# EAGLE design LightLog_SMD_0.7 (EAGLE 7.1.0)
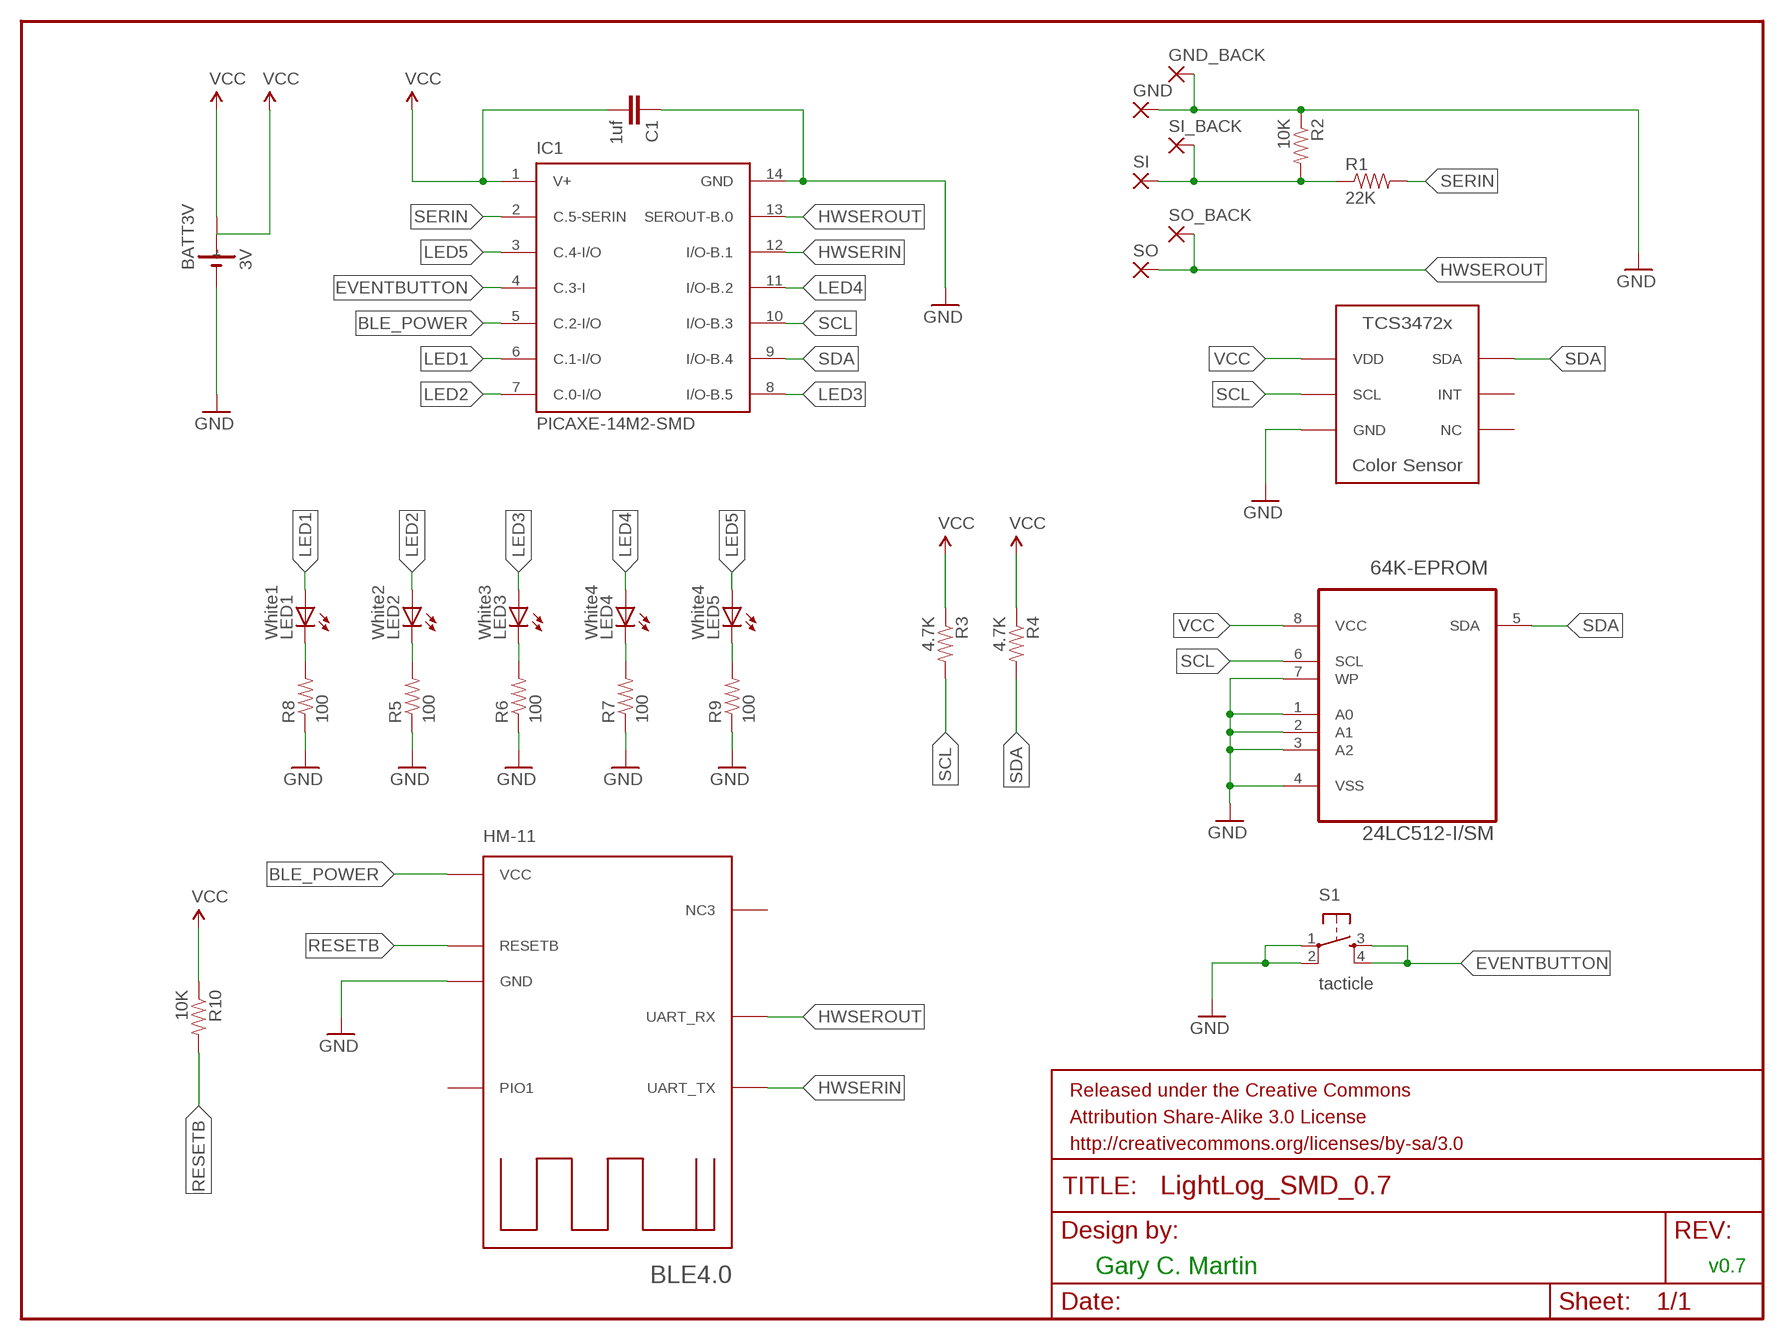
[diagram p0: schematic, sheet 1]

## Parts
64K-EPROM  24LC512-I/SM  [SOIC127P794X203-8N]
BATT3V  3V  BAT-HLD-001-CR2032  [BAT-HLD-001-CR2032-SMD]
BLE4.0  HM-11  HM-11-MIN  [HM-11-MIN]
C1  1uf  CAP0805  [0805]
GND  SMD2  [SMD1,27-2,54]
GND_BACK  SMD2  [SMD1,27-2,54]
IC1  PICAXE-14M2-SMD  [SOIC14]
LED1  White1  LED0603  [LED-0603]
LED2  White2  LED0603  [LED-0603]
LED3  White3  LED0603  [LED-0603]
LED4  White4  LED0603  [LED-0603]
LED5  White4  LED0603  [LED-0603]
R1  22K  RESISTOR0805-RES  [0805]
R2  10K  RESISTOR0805-RES  [0805]
R3  4.7K  RESISTOR0805-RES  [0805]
R4  4.7K  RESISTOR0805-RES  [0805]
R5  100  RESISTOR0805-RES  [0805]
R6  100  RESISTOR0805-RES  [0805]
R7  100  RESISTOR0805-RES  [0805]
R8  100  RESISTOR0805-RES  [0805]
R9  100  RESISTOR0805-RES  [0805]
R10  10K  RESISTOR0805-RES  [0805]
S1  tacticle  TAC_SWITCHSMD  [TACTILE_SWITCH_SMD]
SI  SMD2  [SMD1,27-2,54]
SI_BACK  SMD2  [SMD1,27-2,54]
SO  SMD2  [SMD1,27-2,54]
SO_BACK  SMD2  [SMD1,27-2,54]
U$1  TCS3472  [DUAL-FLAT-NO-LEAD-6PIN]

## Nets
BLE_POWER: BLE4.0.VCC IC1.5(C.2-I/O)
EVENTBUTTON: IC1.4(C.3-I) S1.3 S1.4
GND: 64K-EPROM.1(A0) 64K-EPROM.2(A1) 64K-EPROM.3(A2) 64K-EPROM.4(VSS) 64K-EPROM.7(WP) BATT3V.NEG(-) BLE4.0.GND C1.1 GND.1(P) GND_BACK.1(P) IC1.14(GND) R2.1 R5.1 R6.1 R7.1 R8.1 R9.1 S1.1 S1.2 U$1.3(GND)
HWSERIN: BLE4.0.UART_TX IC1.12(I/O-B.1)
HWSEROUT: BLE4.0.UART_RX IC1.13(SEROUT-B.0) SO.1(P) SO_BACK.1(P)
LED1: IC1.6(C.1-I/O) LED1.A
LED2: IC1.7(C.0-I/O) LED2.A
LED3: IC1.8(I/O-B.5) LED3.A
LED4: IC1.11(I/O-B.2) LED4.A
LED5: IC1.3(C.4-I/O) LED5.A
N$1: LED2.C R5.2
N$2: R1.1 R2.2 SI.1(P) SI_BACK.1(P)
N$3: LED3.C R6.2
N$4: LED4.C R7.2
N$5: LED5.C R9.2
N$11: LED1.C R8.2
RESETB: BLE4.0.RESETB R10.2
SCL: 64K-EPROM.6(SCL) IC1.10(I/O-B.3) R3.2 U$1.2(SCL)
SDA: 64K-EPROM.5(SDA) IC1.9(I/O-B.4) R4.2 U$1.6(SDA)
SERIN: IC1.2(C.5-SERIN) R1.2
VCC: 64K-EPROM.8(VCC) BATT3V.POS1(+) BATT3V.POS2(+) C1.2 IC1.1(V+) R3.1 R4.1 R10.1 U$1.1(VDD)
Unconnected: BLE4.0.NC3 BLE4.0.POI1(PIO1) U$1.4(NC) U$1.5(INT)

## Notes on the sheet
- Gary C. Martin | v0.7

## Library data of the parts
64K-EPROM = gary:24LC512-I/SM: 512K I2C Serial EEPROM; MPN: 24LC512-I/SM; OC_FARNELL: 9758038; OC_NEWARK: 62K0582; PACKAGE: SOIC-8; SUPPLIER: MICROCHIP
BATT3V = gary:BAT-HLD-001-CR2032: CR2032 Holder CR2032 surface mount battery holder
BLE4.0 = gary:HM-11-MIN
C1 = SparkFun-Capacitors:CAP: Capacitor Standard 0603 ceramic capacitor, and 0.1" leaded capacitor.
GND GND_BACK SI SI_BACK SO SO_BACK = wirepad:SMD2: SMD PAD
IC1 = LightLog_SMD_0.6:PICAXE-14M2: PICAXE-14M2 Pic microcontroler.
LED1-LED5 = SparkFun-LED:LED: LEDs Standard schematic elements and footprints for 5mm, 3mm, 1206, and 0603 sized LEDs. 5mm - Spark Fun Electronics SKU : COM-00529 (and others)
R1-R10 = SparkFun-Resistors:RESISTOR: Resistor Basic schematic elements and footprints for 0603, 1206, and PTH resistors.
S1 = gary:TAC_SWITCH: Momentary Switch Button commonly used for reset or general input.
U$1 = gary:TCS3472: TCS3472x device

## Board
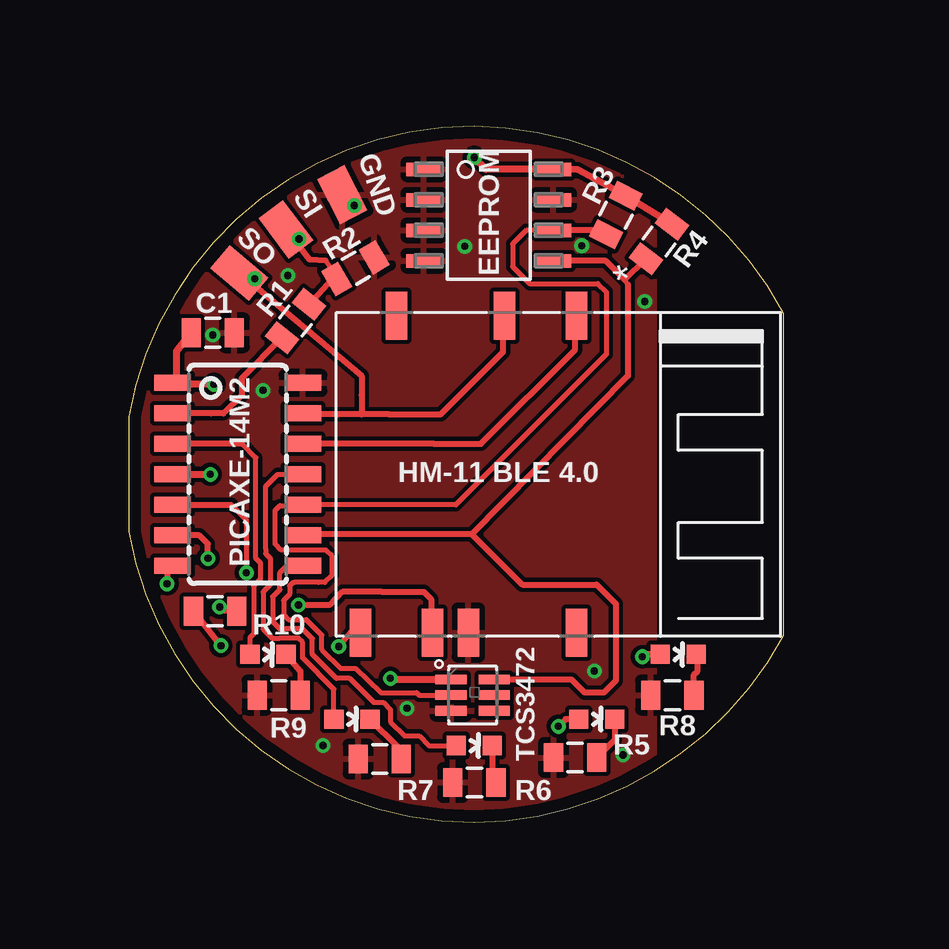
[diagram p1: board, top side]
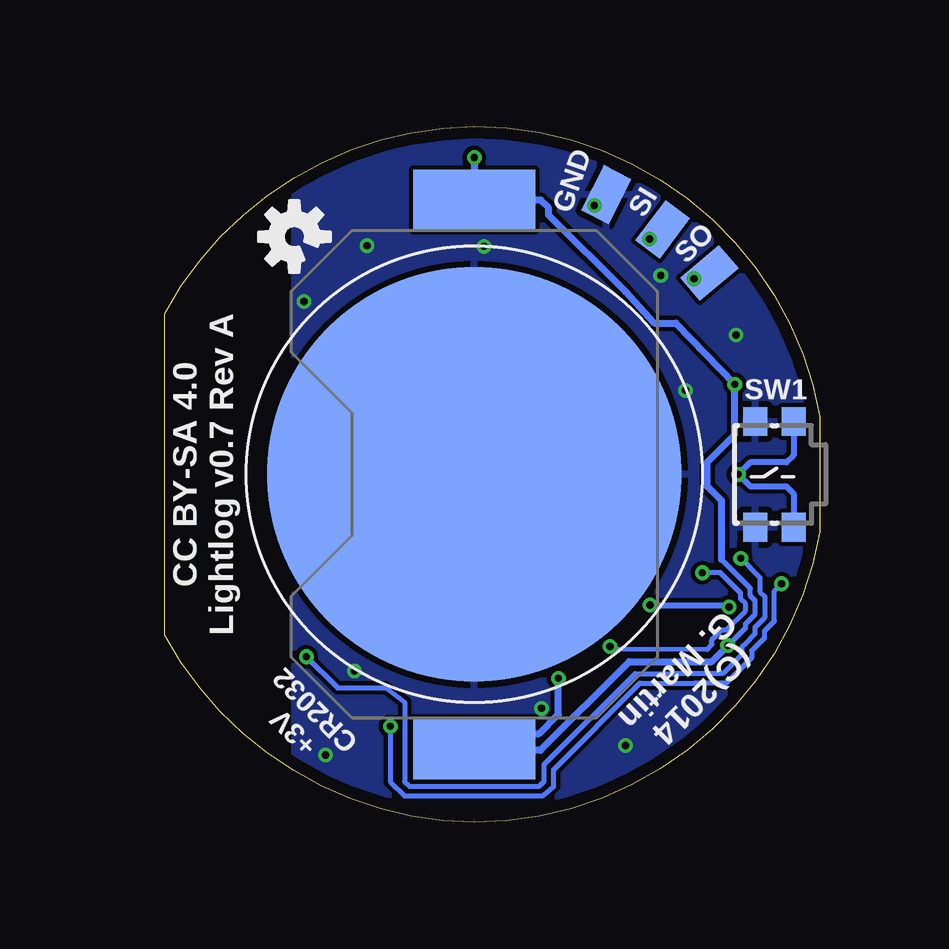
[diagram p2: board, bottom side, seen from below]

Size 27.3 x 29 mm. Coordinates in mm from the lower left corner, seen from the top.
Outline: 14.4,0 arc61 27.3,7.8 27.3,13.5 27.3,15.5 27.3,21.2 arc61 14.4,29 arc80 0,16.9 0,14.7 0,12.1 arc80 14.4,0
Copper layers (1*16): Top 0.035mm / dielectric 1.5mm / Bottom 0.035mm
Design rules "Smart-Prototyping-com-EagleRules *": minimum track width 7mil, minimum drill 12mil, track to track 7mil, track to pad 7mil, pad to pad 7mil, via to via 7mil, smd to smd 0mil, copper to edge 20mil, drill to drill 10mil, minimum pad ring 10mil, minimum via ring 6mil, stop-mask expansion 2mil, vias tented up to drill 25mil, thermal gap 10mil

### Footprints (pad centres in the part's own frame; a part is rotated, then mirrored left to right if it is on the bottom)
SOIC127P794X203-8N = smd 1.473 x 0.559: 1 -2.739,1.905; 2 -2.739,0.635; 3 -2.739,-0.635; 4 -2.739,-1.905; 5 2.659,-1.905; 6 2.659,-0.635; 7 2.659,0.635; 8 2.659,1.905
BAT-HLD-001-CR2032-SMD = smd 17.272 x 17.272: NEG 0,0 | smd 2.54 x 5.08: POS1 -11.43,0; POS2 11.43,0
HM-11-MIN = smd 2 x 0.9: GND 6.6,-3.75; NC3 -6.6,-6.75; POI1 6.6,0.75; RESETB 6.6,-5.25; UART_RX -6.6,-2.25; UART_TX -6.6,0.75; VCC 6.6,-8.25
0805 = smd 0.8 x 1.2: 1 -0.9,0; 2 0.9,0
SMD1,27-2,54 = smd 1.27 x 2.1: 1 0,0
SOIC14 = smd 1.524 x 0.66: 1 -2.878,3.81; 2 -2.878,2.54; 3 -2.878,1.27; 4 -2.878,0; 5 -2.878,-1.27; 6 -2.878,-2.54; 7 -2.878,-3.81; 8 2.561,-3.81; 9 2.561,-2.54; 10 2.561,-1.27; 11 2.561,0; 12 2.561,1.27; 13 2.561,2.54; 14 2.561,3.81
LED-0603 = smd 0.8 x 0.8: A 0,-0.75; C 0,0.75
TACTILE_SWITCH_SMD = smd 1.2 x 1: 1 -2.2,0.805; 2 2.2,0.805; 3 -2.2,-0.805; 4 2.2,-0.805
DUAL-FLAT-NO-LEAD-6PIN = smd 1.3 x 0.4: 1 -0.9,0.65; 2 -0.9,0; 3 -0.9,-0.65; 4 0.9,-0.65; 5 0.9,0; 6 0.9,0.65

### Placement (x,y rotation side)
64K-EPROM  15.04,25.3 0 top
BATT3V  14.4,14.5 270 bottom
BLE4.0  17.9,14.5 270 top
C1  3.5,20.4 180 top
GND  8.9,26.15 207 top
GND_BACK  8.9,26.15 333 bottom
IC1  4.7,14.5 0 top
LED1  22.9,7 270 top
LED2  19.5,4.3 270 top
LED3  14.4,3.2 270 top
LED4  9.3,4.3 270 top
LED5  5.8,7 270 top
LOGO2  OSHW-LOGOS  [OSHW-LOGO-S]  21.9,24.4 45 bottom
R1  6.95,20.88 231 top
R2  9.45,23.09 210 top
R3  20.3,25.3 243 top
R4  22.1,24.2 233 top
R5  18.6,2.7 0 top
R6  14.4,1.66 0 top
R7  10.46,2.64 0 top
R8  22.65,5.3 0 top
R9  6.25,5.3 0 top
R10  3.6,8.8 0 top
S1  1.9,14.5 90 bottom
SI  6.55,24.71 217 top
SI_BACK  6.55,24.71 143 bottom
SO  4.6,22.89 230 top
SO_BACK  4.6,22.89 130 bottom
U$1  14.33,5.3 0 top

### Tracks (layer width: path | path; a pad name or v marks a point on that pad's centre or on a via)
BLE_POWER  (via drill 0.3)
  Top 0.2: 4.27,13.23 4.9,12.6 v4.9,10.4 | BLE4.0.VCC 9.25,7.9
  Top 0.254: IC1.5 4.27,13.23 | 9.25,7.9 v8.75,7.33
  Bottom 0.2: v4.9,10.4 4.15,10.4 3.3,9.55 3.3,9.3 3.1,9.1 3.1,8.82 3.9,8.02 4.1,8.02 4.5,7.6 4.5,7.4 4.7,7.2 8.64,7.22 v8.75,7.33
EVENTBUTTON  (via drill 0.3)
  Top 0.3: IC1.4 v3.4,14.5
  Bottom 0.254: S1.4 1.09,15.3 1.4,15 2.9,15 v3.4,14.5 2.9,14 1.4,14 1.09,13.7 S1.3
GND  (via drill 0.3)
  other vias: 14,24 6.63,22.78 18.87,24.03 3.5,20.3 19.4,6.3 8.1,3.2 21.5,21.7 5.6,18 20.6,2.8 9.4,25.7 11.6,4.75
  pour Top: -1.1,29.5 21.9,29.5 21.9,-1 -1.1,-1
  pour Bottom: -0.6,29 21.9,29 21.9,-0.5 -0.6,-0.5
HWSERIN
  Top 0.2: 18.6,21.05 BLE4.0.UART_TX
  Top 0.254: IC1.12 12.72,15.77 14.67,15.77 18.6,19.7 18.6,21.05
HWSEROUT  (via drill 0.3)
  Top 0.2: 9.7,17 8.7,17 | v5.25,22.65 4.89,22.89 SO_BACK.1 | 15.6,21.05 BLE4.0.UART_RX
  Top 0.254: SO_BACK.1 9.7,18.6 9.7,17.8 9.7,17 | 7.4,17 8.7,17 9.7,17 | 9.7,17 10.85,17 13,17 15.6,19.6 15.6,21.05
  Top 0.3: 7.4,17 IC1.13
  Bottom 0.2: SO_BACK.1 4.39,23.1 v5.25,22.65
LED1  (via drill 0.3)
  Top 0.2: 3,11.9 2.94,11.96
  Top 0.254: LED1.A 21.5,7 v21.4,6.9 | v3.3,11 3.3,11.6 3,11.9 | 2.94,11.96 IC1.6
  Bottom 0.2: v21.4,6.9 20.1,5.6 18.1,5.6 17.3,5 17.3,1.7 17.1,1.5 11.7,1.5 11.5,1.7 11.5,2.4 7.7,6.2 6.05,6.2 4.65,6.2 4.05,6.2 3.25,7 3.25,7.3 3.1,7.45 2.7,7.85 2.7,8.13 2.28,8.55 2.28,9.39 2.5,9.61 2.5,10.2 v3.3,11
LED2  (via drill 0.3)
  Top 0.2: IC1.7 1.9,10.67 1.6,10.37
  Top 0.254: LED2.A 18.2,4.3 v17.9,4 | 1.6,10.37 v1.6,9.94
  Bottom 0.2: v17.9,4 17.9,1.7 17.3,1.1 11.55,1.1 11.1,1.5 11.1,2.2 7.5,5.8 5.2,5.8 3.9,5.8 2.85,6.85 2.85,7.15 2.3,7.7 2.3,7.98 1.9,8.38 1.9,9.64 v1.6,9.94
LED3
  Top 0.2: 13.6,3.2 LED3.A 12.5,3.2 12.1,3.6 11.5,3.6 10.9,4.2 10.9,4.7 10.6,5 10.2,5 9.2,6 8.65,6 7.65,7 7.65,7.65 7.24,8.06 6.52,8.06 6.29,8.06 6,8.35 6,9.4 6.3,9.7 6.3,10.4 6.59,10.69 IC1.8
LED4
  Top 0.2: LED4.A 8.55,5.55 7.25,6.85 7.25,7.5 7.07,7.68 6.3,7.68 5.97,7.68 5.6,8.05 5.6,9.6 5.9,9.9 5.9,11 5.7,11.2 5.7,11.4 5.7,14 6.2,14.5 IC1.11
LED5
  Top 0.2: 4.73,15.77 5.3,15.2 5.3,11 5.5,10.8 5.5,10.15 5.2,9.85 5.2,7.85 5.05,7.7 LED5.A
  Top 0.254: 4.73,15.77 IC1.3
N$1
  Top 0.254: LED2.C 20.25,3.45 R5.2
N$2  (via drill 0.3)
  Top 0.2: SI_BACK.1 7.01,24.2 v7.1,24.3 | 8.49,22.64 8.49,23.02 8.2,23.4
  Top 0.254: R1.1 8.49,22.64 | 8.2,23.4 7.54,23.45 SI_BACK.1
  Top 0.3: 8.49,22.64 R2.2
  Bottom 0.2: v7.1,24.3 6.77,24.58 SI_BACK.1
N$3
  Top 0.254: LED3.C 15.15,1.75
  Top 0.3: 15.15,1.75 R6.2
N$4
  Top 0.2: 11.2,3.15 R7.2
  Top 0.254: LED4.C 11.2,3.15
N$5
  Top 0.254: LED5.C 7.15,6.3 R9.2
N$11
  Top 0.2: 23.7,6.95 LED1.C
  Top 0.254: R8.2 23.55,6.15 23.7,6.3 23.7,6.95
RESETB  (via drill 0.3)
  Top 0.2: R10.2 3.95,8.8 v3.79,8.97 | 12.6,7.95 BLE4.0.RESETB
  Top 0.254: v7.08,9.05 8.37,9.05 8.9,9.6 10.55,9.6 12.3,9.6 12.6,9.3 12.6,7.95
  Bottom 0.2: 3.87,9.05 v3.79,8.97
  Bottom 0.254: v7.08,9.05 3.87,9.05
SCL
  Top 0.2: 64K-EPROM.6 16.56,24.66 16,24.1 16,23.15 16.7,22.45 19.55,22.45 19.9,22.1 19.9,19.5 13.63,13.23 IC1.10 7.33,13.2 6.3,13.2 6.1,13 6.1,11.6 6.36,11.34 8.21,11.34 8.47,11.08 8.47,10.3 8.18,10 7.9,10 6.9,10 6.85,10 6.7,9.85 6.7,9.5 6.45,9.25 6.45,8.65 6.65,8.45 6.9,8.45 7.4,8.45 8.05,7.8 8.05,7.2 8.85,6.4 9.45,6.4 10.5,5.4 12,5.4 12.1,5.3 U$1.2
  Top 0.254: 19.72,24.66 64K-EPROM.6
  Top 0.3: R3.2 19.72,24.66
SDA
  Top 0.2: 20.8,22.4 20.68,22.6
  Top 0.254: R4.2 20.68,22.6 19.88,23.39 64K-EPROM.5 | 20.8,22.4 20.8,18.6 14.3,12 | 14.3,12 7.4,12 | 14.3,12 16.4,9.9 19.5,9.9 20.3,9.1 20.3,5.9 19.8,5.4 19.5,5.4 19,5.4 18.45,5.95 U$1.6
  Top 0.3: 7.4,12 IC1.9
SERIN
  Top 0.254: IC1.2 3.42,17.04 3.94,17.04 4.7,17.8 4.7,18.5 R1.2
VCC  (via drill 0.3)
  Top 0.2: 1.98,18.25 IC1.1
  Top 0.254: v3.84,7.36 R10.1
  Top 0.3: R4.1 R3.1 18.7,27.2 64K-EPROM.8 14.89,27.2 v14.4,27.7 | IC1.1 2,18.39 2,19.63 C1.2 | U$1.1 10.95,5.95 v10.9,6 | v3.55,18.25 1.98,18.25
  Bottom 0.2: 12.33,3.07 13.13,2.87 | 4.1,10.95 2.9,9.75 2.9,9.44 2.7,9.24 2.7,8.68 3.1,8.28 3.1,8.1 v3.84,7.36 | 14.33,3 BATT3V.POS2
  Bottom 0.3: v14.4,27.7 14.4,27.05 BATT3V.POS1 | 12.33,3.07 BATT3V.POS2 13.77,3.7 11.7,3.7 10.9,4.5 v10.9,6 | v3.84,7.36 4.5,6.7 7.95,6.7 11.65,3 14.33,3 | 4.1,10.95 4.1,13.4 4.7,14 4.7,15 3.55,16.15 v3.55,18.25 6,20.8 6.9,20.8 8.1,22.1 11.3,25.3 11.3,25.6 11.63,25.93 BATT3V.POS1 | 11.93,25.93 BATT3V.POS1

### Text on the board
tPlace: R3 | EEPROM | R2 | R4 | C1 | R1 | PICAXE-14M2 | HM-11 BLE 4.0 | R10 | TCS3472 | R9 | R8 | R5 | R7 | R6
bPlace: GND | SI | SO | SW1 | CC BY-SA 4.0 / Lightlog v0.7 Rev A | (C)2014 / G. Martin | +3V / CR2032